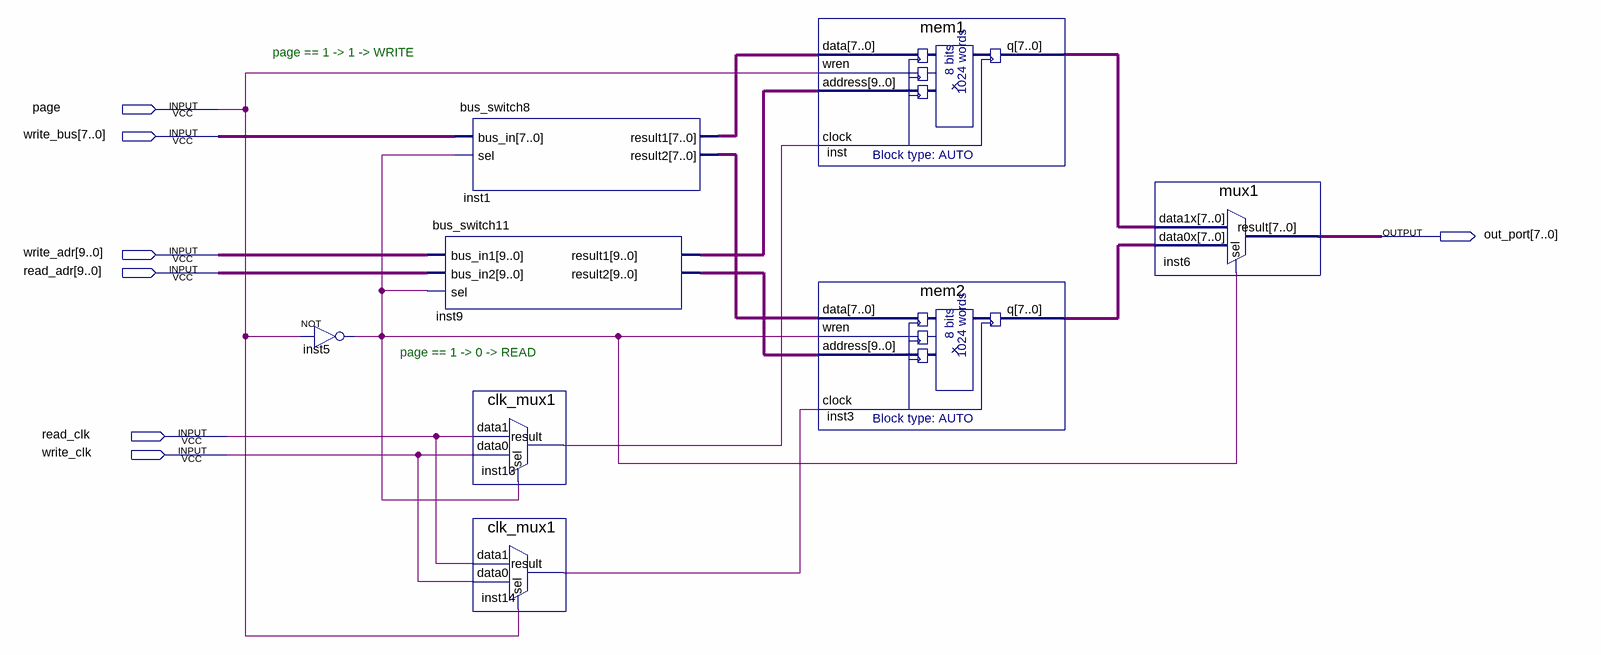
[diagram p0: schematic sheet]
// Quartus schematic mem_module.bdf as structural Verilog: 8 symbols, 7 pins
module mem_module (
  input  page,
  input  [7:0] write_bus,
  input  [9:0] write_adr,
  input  [9:0] read_adr,
  input  read_clk,
  input  write_clk,
  output [7:0] out_port
);

  wire inst5_out, inst13_result, inst14_result;
  wire [7:0] inst1_result1, inst1_result2, inst3_q, inst_q;
  wire [9:0] inst9_result1, inst9_result2;

  not inst5 (inst5_out, page);
  bus_switch11 inst9 (
    .bus_in1(write_adr), .bus_in2(read_adr), .sel(inst5_out), .result1(inst9_result1), .result2(inst9_result2));
  bus_switch8 inst1 (.bus_in(write_bus), .sel(inst5_out), .result1(inst1_result1), .result2(inst1_result2));
  clk_mux1 inst13 (.data1(read_clk), .data0(write_clk), .sel(inst5_out), .result(inst13_result));
  clk_mux1 inst14 (.data1(read_clk), .data0(write_clk), .sel(page), .result(inst14_result));
  mem1 inst (.data(inst1_result1), .wren(page), .address(inst9_result1), .clock(inst13_result), .q(inst_q));
  mem2 inst3 (.data(inst1_result2), .wren(inst5_out), .address(inst9_result2), .clock(inst14_result), .q(inst3_q));
  mux1 inst6 (.data1x(inst_q), .data0x(inst3_q), .sel(inst5_out), .result(out_port));

  // Notes on the sheet:
  //   page == 1 -> 1 -> WRITE
  //   page == 1 -> 0 -> READ
endmodule
